# EAGLE design protomesure (EAGLE 8.1.1)
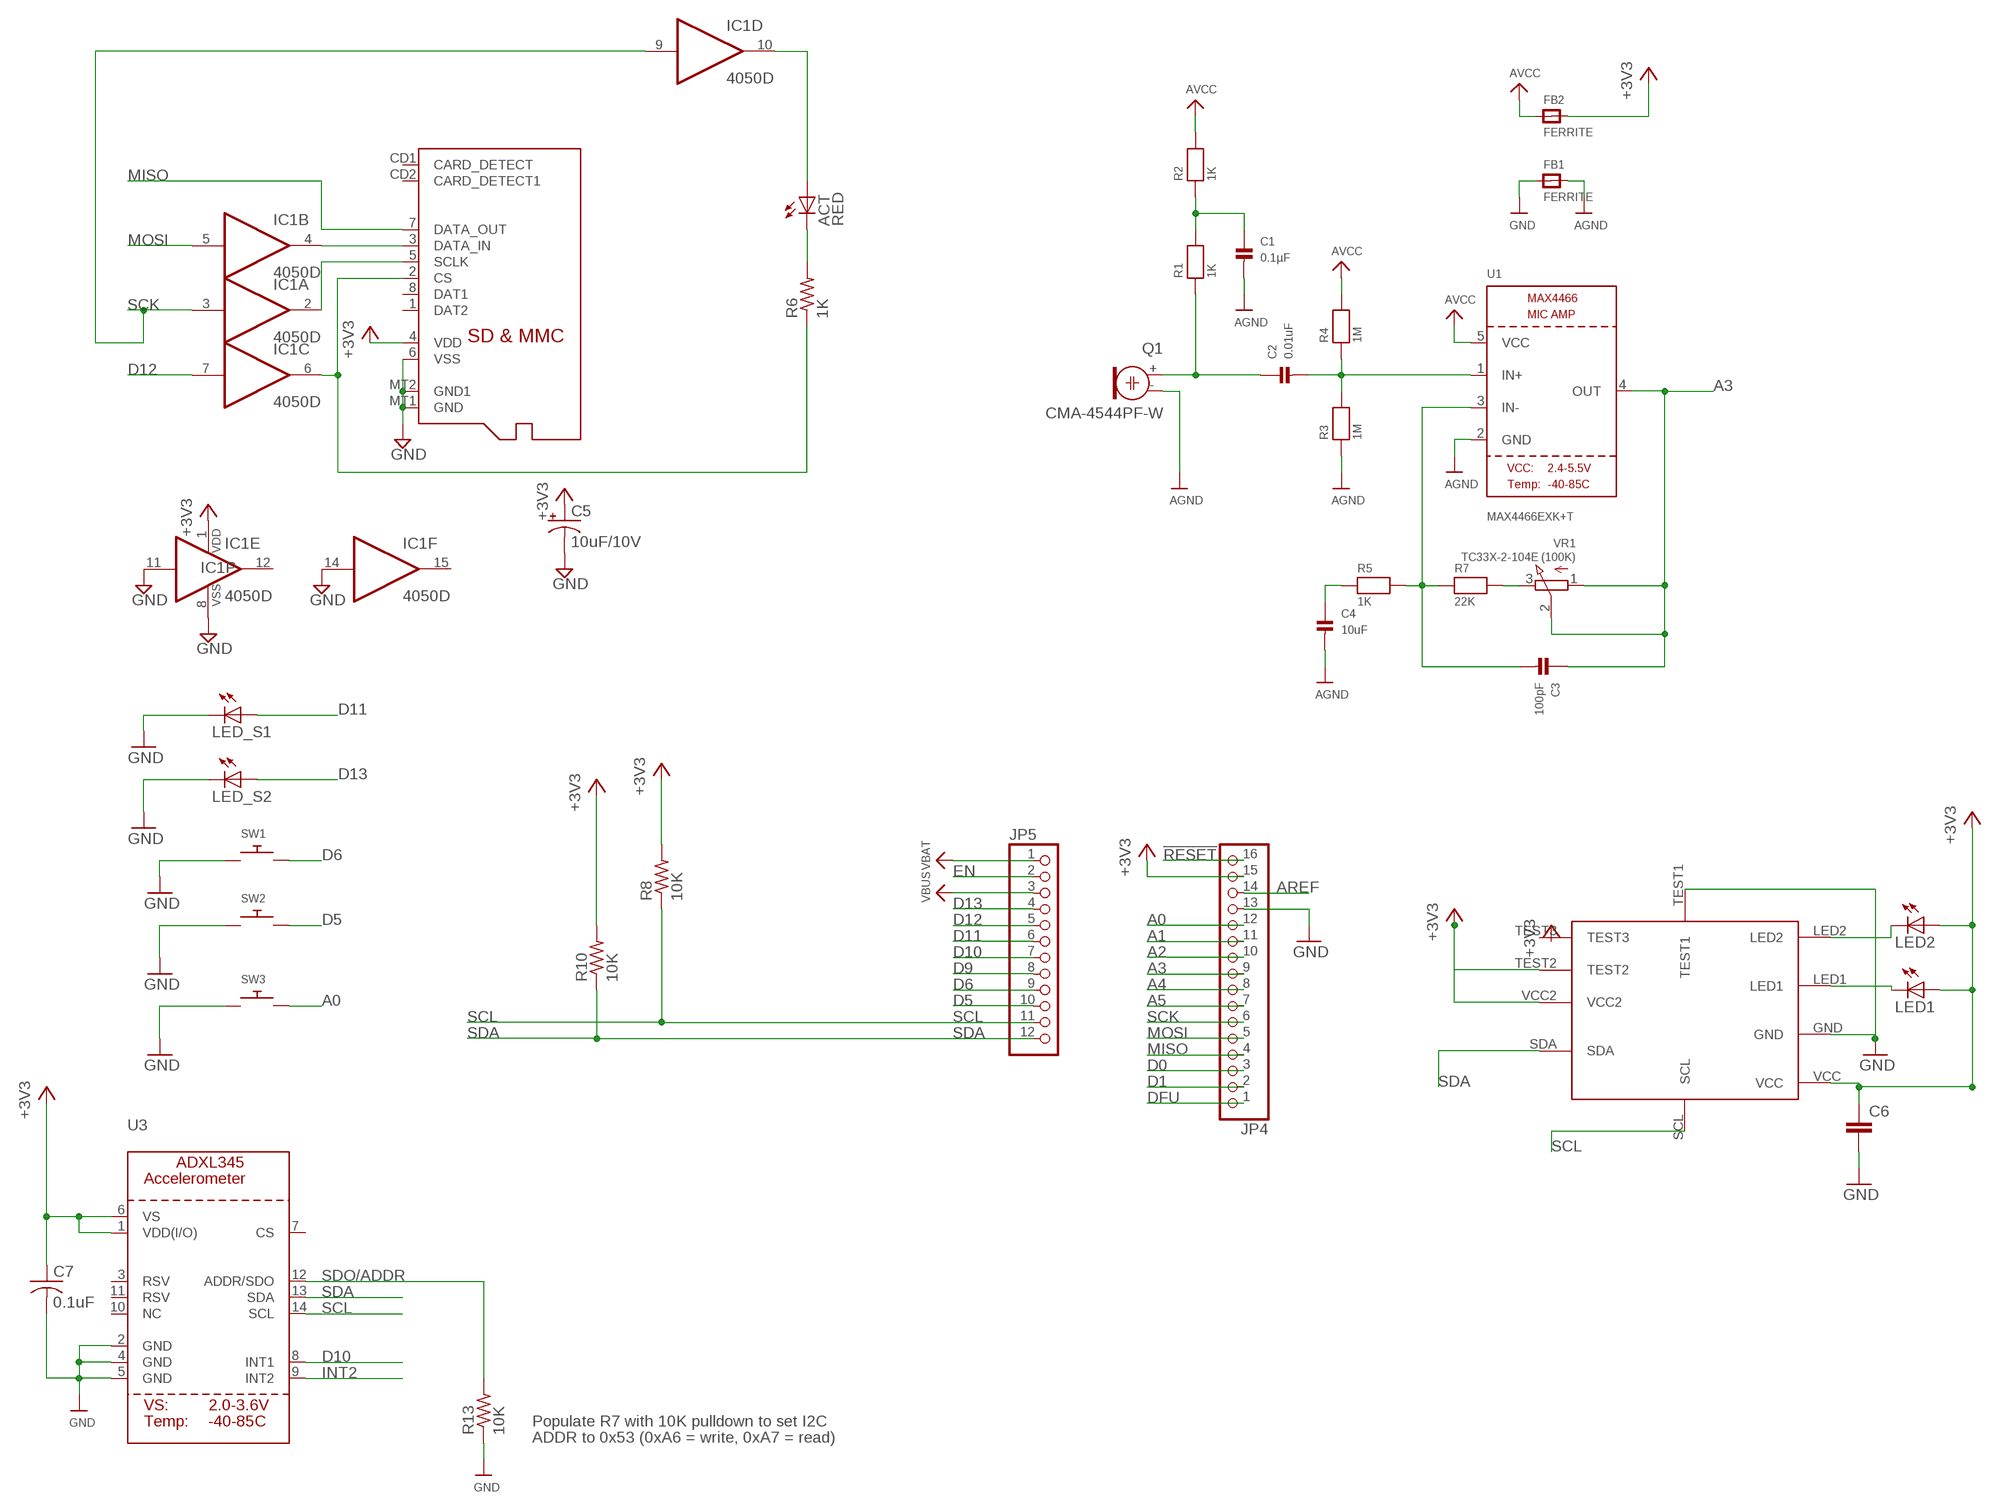
[diagram p0: schematic, sheet 1]

## Parts
ACT  RED  LEDCHIP-LED0805  [CHIP-LED0805]
C1  0.1µF  CAP_CERAMIC0805  [0805]
C2  0.01uF  CAP_CERAMIC0805  [0805]
C3  100pF  CAP_CERAMIC0805  [0805]
C4  10uF  CAP_CERAMIC0805  [0805]
C5  10uF/10V  CPOL-USA/3216-18R  [A/3216-18R]
C6  C-EUC0805  [C0805]
C7  0.1uF  C-USC0805  [C0805]
FB1  FERRITE  FERRITE0805  [0805]
FB2  FERRITE  FERRITE0805  [0805]
IC1  4050D  [SO16]
JP4  HEADER-1X16ROUND  [1X16_ROUND]
JP5  HEADER-1X12  [1X12_ROUND]
LED1  LEDCHIPLED_0805  [CHIPLED_0805]
LED2  LEDCHIPLED_0805  [CHIPLED_0805]
LED_S1  LEDCHIPLED_0805  [CHIPLED_0805]
LED_S2  LEDCHIPLED_0805  [CHIPLED_0805]
Q1  CMA-4544PF-W  ELECTRET  [ELECTRET_9.7]
R1  1K  RESISTOR0805  [0805]
R2  1K  RESISTOR0805  [0805]
R3  1M  RESISTOR0805  [0805]
R4  1M  RESISTOR0805  [0805]
R5  1K  RESISTOR0805  [0805]
R6  1K  R-US_R0805  [R0805]
R7  22K  RESISTOR0805  [0805]
R8  10K  R-US_R0805  [R0805]
R10  10K  R-US_R0805  [R0805]
R13  10K  R-US_R0805  [R0805]
SW1  SWITCH_PUSHBUTTONEVQ-PE  [TACT_PANA-EVQ]
SW2  SWITCH_PUSHBUTTONEVQ-PE  [TACT_PANA-EVQ]
SW3  SWITCH_PUSHBUTTONEVQ-PE  [TACT_PANA-EVQ]
U1  MAX4466EXK+T  MAX4466""  [SC70-5]
U3  ACCEL_ADXL345  [LGA14]
U$31  BH1790  [BH1790]
VR1  TC33X-2-104E (100K)  TRIMPOTTC33X-2  [TRIMPOT_BOURNS_TC33X-2]
X1  MICROSD  [MICROSD]

## Nets
!RESET: JP4.16
+3V3: C5.+ C6.1 C7.1 FB2.2 IC1.1(P:VDD) JP4.15 LED1.A LED2.A R8.2 R10.2 U3.1(VDD(I/O)) U3.6(VS) U$31.TEST2 U$31.VCC U$31.VCC2 X1.4(VDD)
A0: JP4.12 SW3.P$2
A1: JP4.11
A2: JP4.10
A3: C3.1 JP4.9 U1.4(OUT) VR1.1(A) VR1.2(S)
A4: JP4.8
A5: JP4.7
AGND: C1.2 C4.2 FB1.2 Q1.- R3.1 U1.2(GND)
AREF: JP4.14
AVCC: FB2.1 R2.2 R4.2 U1.5(VCC)
D0: JP4.3
D1: JP4.2
D5: JP5.10 SW2.P$2
D6: JP5.9 SW1.P$2
D9: JP5.8
D10: JP5.7 U3.8(INT1)
D11: JP5.6 LED_S1.A
D12: IC1.7(C:I) JP5.5
D13: JP5.4 LED_S2.A
DFU: JP4.1
EN: JP5.2
GND: C5.- C6.2 C7.2 FB1.1 IC1.8(P:VSS) IC1.11(E:I) IC1.14(F:I) JP4.13 LED_S1.C LED_S2.C R13.1 SW1.P$1 SW2.P$1 SW3.P$1 U3.2(GND) U3.4(GND) U3.5(GND) U$31.GND U$31.TEST1 X1.6(VSS) X1.MT1(GND) X1.MT2(GND1)
INT2: U3.9(INT2)
MISO: JP4.4 X1.7(DATA_OUT)
MOSI: IC1.5(B:I) JP4.5
N$1: C3.2 R5.2 R7.1 U1.3(IN-)
N$2: R7.2 VR1.3(E)
N$3: C2.1 Q1.+ R1.1
N$4: C1.1 R1.2 R2.1
N$5: C2.2 R3.2 R4.1 U1.1(IN+)
N$6: LED1.C U$31.LED1
N$7: C4.1 R5.1
N$8: ACT.A IC1.10(D:O)
N$9: IC1.2(A:O) X1.5(SCLK)
N$10: IC1.6(C:O) R6.1 X1.2(CS)
N$11: ACT.C R6.2
N$12: IC1.4(B:O) X1.3(DATA_IN)
N$14: LED2.C U$31.LED2
SCK: IC1.3(A:I) IC1.9(D:I) JP4.6
SCL: JP5.11 R8.1 U3.14(SCL) U$31.SCL
SDA: JP5.12 R10.1 U3.13(SDA) U$31.SDA
SDO/ADDR: R13.2 U3.12(ADDR/SDO)
VBAT: JP5.1
VBUS: JP5.3
Unconnected: IC1.12(E:O) IC1.15(F:O) U3.3(RSV) U3.7(CS) U3.10(NC) U3.11(RSV) U$31.TEST3 X1.1(DAT2) X1.8(DAT1) X1.CD1(CARD_DETECT) X1.CD2(CARD_DETECT1)

## Notes on the sheet
- Populate R7 with 10K pulldown to set I2C
- ADDR to 0x53 (0xA6 = write, 0xA7 = read)

## Library data of the parts
ACT LED1 LED2 LED_S1 LED_S2 = adafruit:LED: LED OSRAM: - CHIPLED LG R971, LG N971, LY N971, LG Q971, LY Q971, LO R971, LY R971 LH N974, LH R974 LS Q976, LO Q976, LY Q976 LO Q996 - Hyper CHIPLED LW Q18S LB Q993, LB Q99A, LB R99A - SideLED LS A670, LO A670, LY A670, LG A670, LP A670 LB A673, LV A673, LT A673, LW A673 LH A674 LY A675 LS A676, LA A676, LO A676, LY A676, LW A676 LS A679, LY A679, LG A679 - Hyper Micro SIDELED® LS Y876, LA Y876, LO Y876, LY Y876 LT Y87S - SmartLED LW L88C, LW L88S LB L89C, LB L89S, LG L890 LS L89K, LO L89K, LY L89K LS L896, LA L896, LO L896, LY L896 - TOPLED LS T670, LO T670, LY T670, LG T670, LP T670 LSG T670, LSP T670, LSY T670, LOP T670, LYG T670 LG T671, LOG T671, LSG T671 LB T673, LV T673, LT T673, LW T673 LH T674 LS T676, LA T676, LO T676, LY T676, LB T676, LH T676, LSB T676, LW T676 LB T67C, LV T67C, LT T67C, LS T67K, LO T67K, LY T67K, LW E67C LS E67B, LA E67B, LO E67B, LY E67B, LB E67C, LV E67C, LT E67C LW T67C LS T679, LY T679, LG T679 LS T770, LO T770, LY T770, LG T770, LP T770 LB T773, LV T773, LT T773, LW T773 LH T774 LS E675, LA E675, LY E675, LS T675 LS T776, LA T776, LO T776, LY T776, LB T776 LHGB T686 LT T68C, LB T68C - Hyper Mini TOPLED® LB M676 - Mini TOPLED Santana® LG M470 LS M47K, LO M47K, LY M47K Source: http://www.osram.convergy.de/
C1-C4 = microbuilder:CAP_CERAMIC: Ceramic Capacitors 0402 - 0402 Surface Mount Capacitors 16pF 50V 5% [Digikey: 445-4899-2-ND] 18pF 50V 5% [Digikey: 490-1281-2-ND] 22pF 50V 5% [Digikey: 490-1283-2-ND] 68pF 50V 5% [Digikey: 490-1289-2-ND] 0.1uF 10V 10% [Digikey: 490-1318-2-ND] 1.0uF 6.3V 10% [Digikey: 490-1320-2-ND] 0603 - 0603 Surface Mount Capacitors 16 pF 50V 5% [Digikey: 445-5051-2-ND] 22 pF 50V [Digikey: PCC220ACVTR-ND] 33 pF 50V 5% [Digikey: 490-1415-1-ND] 56pF 50V 5% [Digikey: 490-1421-1-ND] 220pF 50V 5% [Digikey: 445-1285-1-ND] 680 pF 50V 2200 pF 50V 5% C0G [Digikey: 445-1297-1-ND] 5600 pF 100V 5% X7R [Digikey: 478-3711-1-ND] 0.1 µF 25V 10% [Digikey: PCC2277TR-ND] 0.22 µF 16V 10% X7R [Digikey: 445-1318-1-ND] 1.0 µF 25V 10% [Digikey: 445-5146-2-ND] 0603 - RF Specific 3pF 250V +/-0.1pF RF [Digikey: 712-1347-1-ND] 18 pF 250V 5% [Digikey: 478-3505-1-ND or 712-1322-1-ND] 56 pF 250V 5% C0G RF [Digikey: 490-4867-1-ND] 68 pF 250V RF [Digikey: 490-4868-1-ND] 0805 - 0805 Surface Mount Capacitors 220 pF 250V 2% RF Ceramic Capacitor [Digikey: 712-1398-1-ND] 1000 pF 50V 2% NP0 Ceramic Capacitor [Digikey: 478-3760-1-ND] 0.1 µF 25V 10% Ceramic Capacitor [Digikey: PCC1828TR-ND] 1.0 µF 16V 10% Ceramic Capacitor[Digikey: 490-1691-2-ND] 10.0 µF 10V 10% Ceramic Capacitor[Digikey: 709-1228-1-ND] 10.0 uF 16V 10% Ceramic Capacitor [Digikey: 478-5165-2-ND] 47 uF 6.3V 20% Ceramic Capacitor [Digikey: 587-1779-1-ND or 399-5506-1-ND] 1206 - 1206 Surface Mount Capacitors 47uF 10V 20% Ceramic Capacitor [Digikey: 490-5528-1-ND or 399-5508-1-ND or 445-6010-1-ND] 100uF 6.3V -20%, +80% Y5V Ceramic Capacitor (Digikey: 490-4512-1-ND, Mouser: 81-GRM31CF50J107ZE1L)
C5 = adafruit:CPOL-US: POLARIZED CAPACITOR, American symbol
C6 = resistor:C-EU: CAPACITOR, European symbol
C7 = adafruit:C-US: CAPACITOR, American symbol
FB1 FB2 = microbuilder:FERRITE: Ferrite Bead 0603 MMZ1608B121C - 120 Ohm @ 100MHz, 600mA, 0.15 Ohm DC Resistance - Digikey: 445-2164-1-ND BK1608HW121-T - 120 Ohm, 600mA Ferrite Chip - Digikey: 587-1876-2-ND 0805 HZ0805B272R-10 - 2.7K Ohm @ 100MHz, 200mA, 0.8 Ohm DC Resistance - Digikey: 240-2504-1-ND (see also Murata BLM21BD272SN1L) MMZ2012Y152B - 1.5K Ohm @ 100MHz, 500mA, 0.4 Ohm DC Resistance - Digikey: 445-1560-1-ND - Mainly for high frequency (80-400MHz) MMZ2012R102A - 1K Ohm @ 100MHz, 500mA, 0.3 Ohm DC Resistance - Digikey: 445-1555-2-ND - More general purpose (10-200MHz)
IC1 = 40xx:4050: Hex non-inverting BUFFER
JP4 = microbuilder:HEADER-1X16: PIN HEADER
JP5 = microbuilder:HEADER-1X12
Q1 = microbuilder:ELECTRET: Electret microphone Thru hole 2.54mm spacing with 9.7mm diameter
R1-R5 R7 = microbuilder:RESISTOR: Resistors 0402 - 0402 Surface Mount Package 22 Ohm 1% 1/16W [Digikey: 311-22.0LRTR-ND] 33 Ohm 5% 1/16W 1.0K 5% 1/16W 1.5K 5% 1/16W 2.0K 1% 1/16W 10.0K 1% 1/16W [Digikey: 311-10.0KLRTR-ND] 10.0K 5% 1/16W [Digikey: RMCF0402JT10K0TR-ND] 12.1K 1% 1/16W [Digikey: 311-22.0LRTR-ND] 100.0K 5% 1/16W 0603 - 0603 Surface Mount Package 0 Ohm 1/10 Watt 1% Resistor 15 Ohm 1/10 Watt 1% Resistor 33 Ohm 1/10 Watt 1% Resistor 49.9 Ohm 1/10 Watt 1% Resistor 100 Ohm 1/10 Watt 1% Resistor 150 Ohm 1/10 Watt 1% Resistor 240 Ohm 1/10 Watt 1% Resistor 390 Ohm 1/10 Watt 1% Resistor 560 Ohm 1/10 Watt 1% Resistor 680 Ohm 1/10 Watt 1% Resistor 750 Ohm 1/10 Watt 1% Resistor 1.0K Ohm 1/10 Watt 1% Resistor 1.5K Ohm 1/10 Watt 1% Resistor 2.0K Ohm 1/10 Watt 1% Resistor 2.2K Ohm 1/10 Watt 1% Resistor 3.3K Ohm 1/10 Watt 1% Resistor 4.7K Ohm 1/10 Watt 1% Resistor 10.0K Ohm 1/10 Watt 1% Resistor 12.0K Ohm 1/10 Watt 1% Resistor 12.1K Ohm 1/10 Watt 1% Resistor 20.0K Ohm 1/10 Watt 1% Resistor 33.0K Ohm 1/10 Watt 1% Resistor 100.0K Ohm 1/10 Watt 1% Resistor 0805 - 0805 Surface Mount Package 0 Ohm 1/8 Watt 1% Resistor 33 Ohm 1/8 Watt 1% Resistor 100 Ohm 1/8 Watt 1% Resistor 150 Ohm 1/8 Watt 1% Resistor 200 Ohm 1/8 Watt 1% Resistor 240 Ohm 1/8 Watt 1% Resistor 330 Ohm 1/8 Watt 1% Resistor 390 Ohm 1/8 Watt 1% Resistor 470 Ohm 1/8 Watt 1% Resistor 1.0K Ohm 1/8 Watt 1% Resistor 1.5K Ohm 1/8 Watt 1% Resistor 2.0K Ohm 1/8 Watt 1% Resistor 4.7K Ohm 1/8 Watt 1% Resistor 5.1K Ohm 1/8 Watt 1% Resistor 5.6K Ohm 1/8 Watt 1% Resistor 10.0K Ohm 1/8 Watt 1% Resistor 22.0K Ohm 1/8 Watt 1% Resistor 33.0K Ohm 1/8 Watt 1% Resistor 100K Ohm 1/8 Watt 1% Resistor 1206 - 1206 Surface Mount Package 2012 - 2010 Surface Mount Package 0.11 Ohm 1/2 Watt 1% Resistor - Digikey: RHM.11UCT-ND
R6 R8 R10 R13 = adafruit:R-US_: RESISTOR, American symbol
SW1-SW3 = adafruit:SWITCH_PUSHBUTTON: Buttons SOFTTOUCHSMD_SJ - Soft touch temporary push button (Super Junk Akihabara) Compatible with SKPMANE010 [Mouser: 688-SKPMAN] C&K_KSS = Digikey: KSS221GLFS
U1 = microbuilder:MAX4466: MAX4466 - Microphone Pre-Amp
U3 = microbuilder:ACCEL_ADXL345: ADXL345 - Digital 3-Axis Accelerometer (I2C/SPI)
U$31 = quentin:BH1790
VR1 = microbuilder:TRIMPOT: 3-Pin SMT Trimpots Bourns TC33 (X-2) Series 10K - Digikey: TC33X-2-103E 100K - Digikey: TC33X-104ECT-ND Bourns 3303 (W) Series 3mm 10K Single Turn - Digikey: 3303W-103ETR-ND 3mm 100K Single Turn - Digikey: 3303X-104ETR-ND
X1 = adafruit:MICROSD: Micro-SD / Transflash card holder with SPI pinout For the 3M # 2908-05WB-MG and/or 4UCON #19656 push-push type

## Board
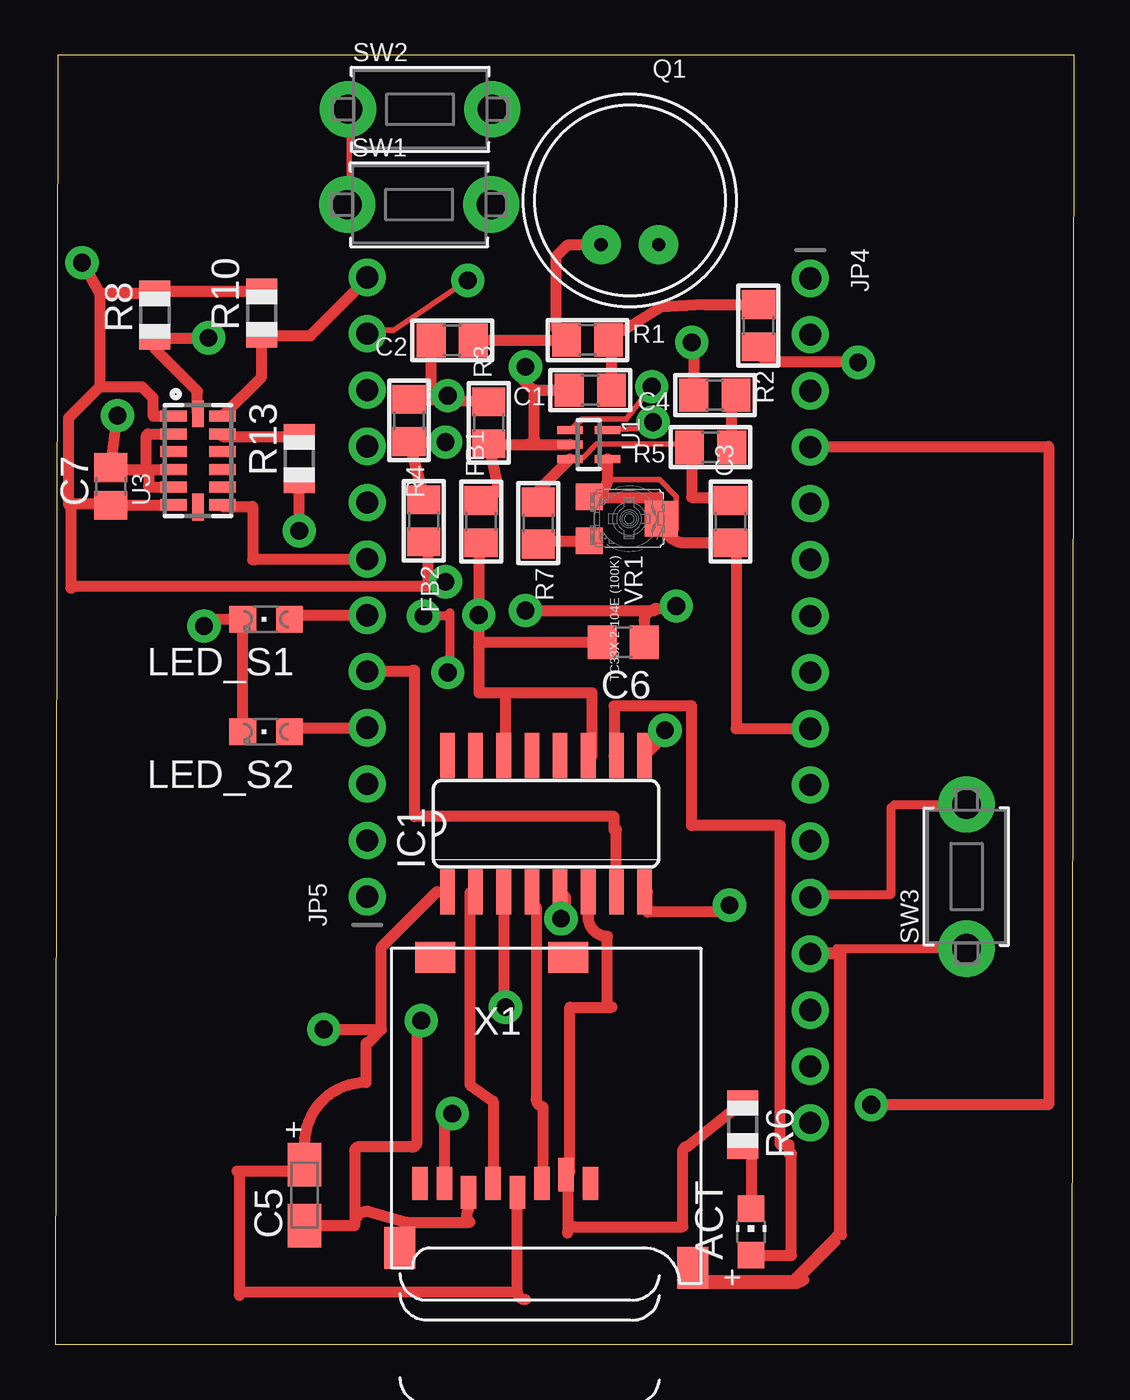
[diagram p1: board, top side]
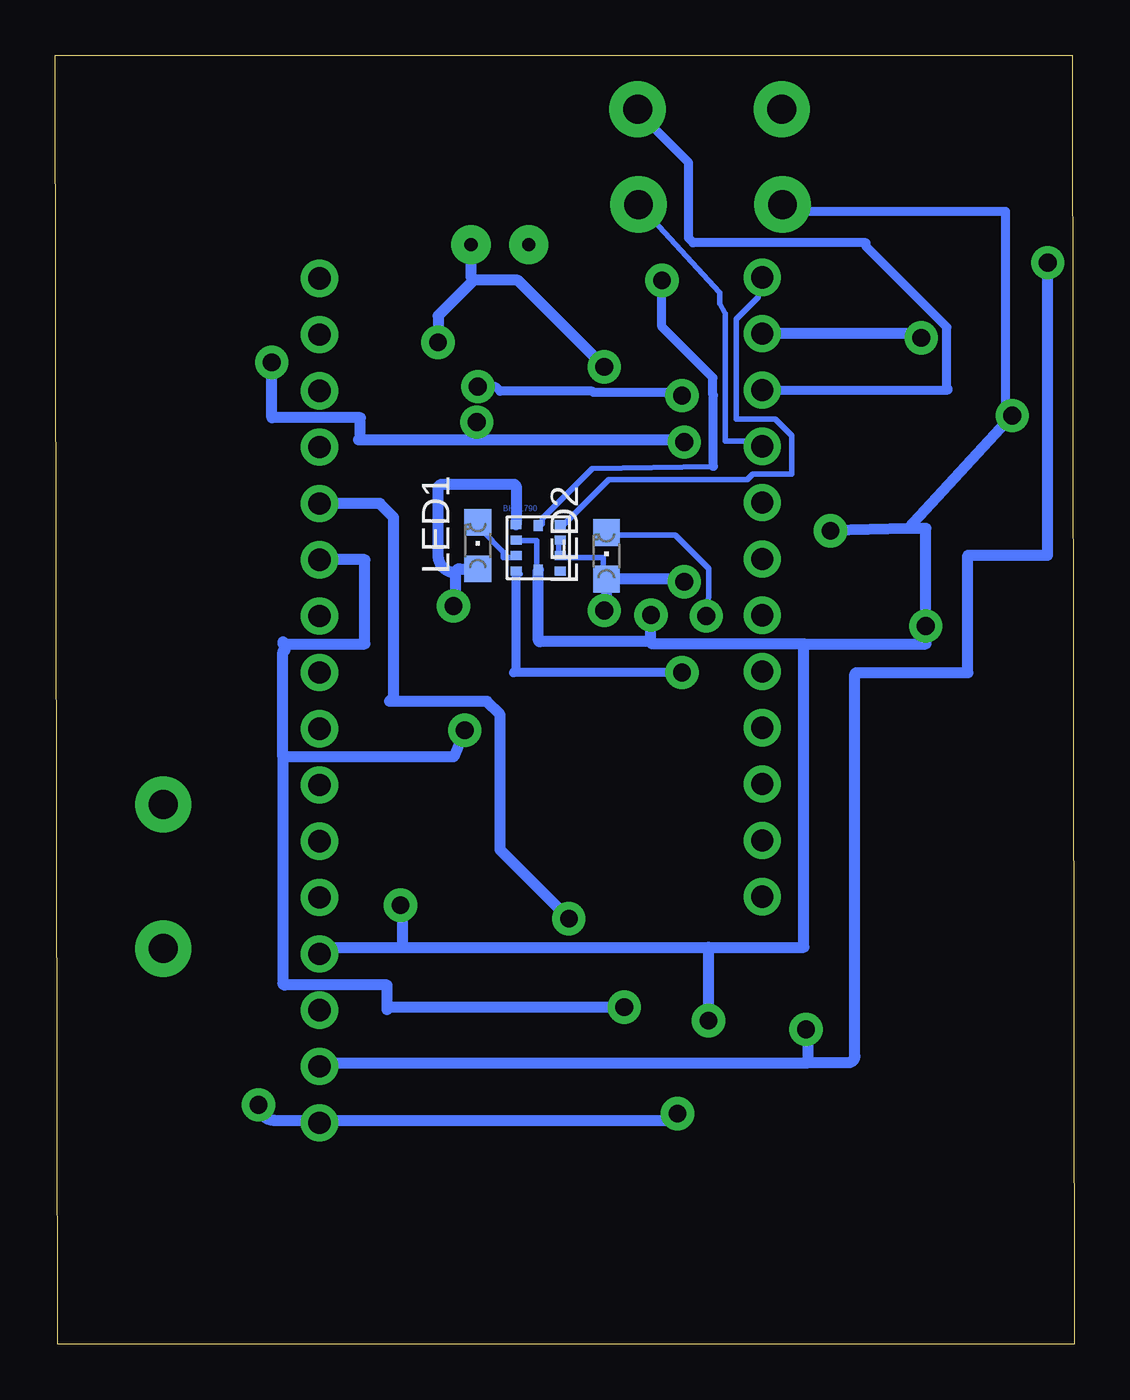
[diagram p2: board, bottom side, seen from below]

Size 45.96 x 58.15 mm. Coordinates in mm from the lower left corner, seen from the top.
Outline: 0,0 45.86,0 45.96,58.15 0.1,58.15 0,0
Copper layers (1*16): Top 0.035mm / dielectric 1.5mm / Bottom 0.035mm
Design rules "default": minimum track width 10mil, minimum drill 24mil, track to track 8mil, track to pad 8mil, pad to pad 8mil, via to via 8mil, smd to smd 8mil, copper to edge 40mil, drill to drill 8mil, minimum pad ring 10mil, minimum via ring 8mil, stop-mask expansion 4mil, vias tented up to drill 0mil, thermal gap 10mil

### Footprints (pad centres in the part's own frame; a part is rotated, then mirrored left to right if it is on the bottom)
CHIP-LED0805 = smd 1.2 x 1.2: A 0,-1.05; C 0,1.05
0805 = smd 1.3 x 1.5: 1 -0.95,0; 2 0.95,0
A/3216-18R = smd 1.95 x 1.5: + 1.375,0; - -1.375,0
C0805 = smd 1.3 x 1.5: 1 -0.95,0; 2 0.95,0
C0805' = smd 1.3 x 1.5: 1 -0.85,0; 2 0.85,0
SO16 = smd 0.66 x 2.032: 1 -4.445,-3.073; 2 -3.175,-3.073; 3 -1.905,-3.073; 4 -0.635,-3.073; 5 0.635,-3.073; 6 1.905,-3.073; 7 3.175,-3.073; 8 4.445,-3.073; 9 4.445,3.073; 10 3.175,3.073; 11 1.905,3.073; 12 0.635,3.073; 13 -0.635,3.073; 14 -1.905,3.073; 15 -3.175,3.073; 16 -4.445,3.073
1X16_ROUND = drill 1 pad 1.676: 1 -19.05,0; 2 -16.51,0; 3 -13.97,0; 4 -11.43,0; 5 -8.89,0; 6 -6.35,0; 7 -3.81,0; 8 -1.27,0; 9 1.27,0; 10 3.81,0; 11 6.35,0; 12 8.89,0; 13 11.43,0; 14 13.97,0; 15 16.51,0; 16 19.05,0
1X12_ROUND = drill 1 pad 1.676: 1 -13.97,0; 2 -11.43,0; 3 -8.89,0; 4 -6.35,0; 5 -3.81,0; 6 -1.27,0; 7 1.27,0; 8 3.81,0; 9 6.35,0; 10 8.89,0; 11 11.43,0; 12 13.97,0
CHIPLED_0805 = smd 1.2 x 1.2: A 0,-1.05; C 0,1.05
ELECTRET_9.7 = drill 0.6 pad 1.778: + 1.3,2; - -1.3,2
R0805 = smd 1.1 x 1.4: 1 -1,0; 2 1,0
TACT_PANA-EVQ = drill 1.3 pad 2.54: P$1 -3.25,0; P$2 3.25,0
SC70-5 = smd 0.35 x 1.15: 1 -0.65,-0.85; 2 0,-0.85; 3 0.65,-0.85; 4 0.65,0.85; 5 -0.65,0.85
LGA14 = smd 0.5 x 1.2: 1 2,1.1; 2 1.2,1.1; 3 0.4,1.1; 4 -0.4,1.1; 5 -1.2,1.1; 6 -2,1.1; 8 -2,-1.1; 9 -1.2,-1.1; 10 -0.4,-1.1; 11 0.4,-1.1; 12 1.2,-1.1; 13 2,-1.1 | smd 1.2 x 0.5: 7 -2.1,0; 14 2.1,0
BH1790 = smd 0.5 x 0.4: GND -1,0.35; LED1 -1,-0.35; LED2 -1,-1.05; SDA 1,1.05; TEST2 1,-0.35; TEST3 1,-1.05; VCC -1,1.05; VCC2 1,0.35 | smd 0.4 x 0.5: SCL 0,1; TEST1 0,-1
TRIMPOT_BOURNS_TC33X-2 = smd 1.2 x 1.2: 1 -1,-1.8; 3 1,-1.8 | smd 1.6 x 1.5: 2 0,1.45
MICROSD = smd 0.7 x 1.5: 1 9,-10.64; 2 7.9,-10.24; 3 6.8,-10.64; 4 5.7,-11.04; 5 4.6,-10.64; 6 3.5,-11.04; 7 2.4,-10.64; 8 1.3,-10.64 | smd 1.8 x 1.4: CD1 2,-0.44; CD2 8,-0.44 | smd 1.4 x 1.9: MT1 0.4,-13.54; MT2 13.6,-14.44

### Placement (x,y rotation side)
ACT  31.38,5.07 0 top
C1  24.13,43.05 180 top
C2  17.9,45.29 180 top
C3  30.45,37.11 90 top
C4  29.75,42.82 180 top
C5  11.23,6.72 90 top
C6  25.61,31.67 180 top
C7  0.1uF  [C0805']  2.5,38.7 90 top
FB1  19.2,37.11 90 top
FB2  16.61,37.15 270 top
IC1  22.13,23.48 0 top
JP4  34.05,29.04 270 top
JP5  14.07,34.16 90 top
LED1  26.91,36.03 0 bottom
LED2  21.11,35.57 0 bottom
LED_S1  9.5,32.71 90 top
LED_S2  9.5,27.63 90 top
Q1  25.91,51.61 180 top
R1  24,45.31 0 top
R2  31.71,45.95 270 top
R3  19.55,41.57 90 top
R4  15.95,41.68 270 top
R5  29.55,40.47 180 top
R6  31.01,9.91 270 top
R7  21.78,37.05 270 top
R8  4.49,46.43 90 top
R10  9.3,46.52 90 top
R13  11,39.96 90 top
SW1  16.41,51.42 0 top
SW2  16.45,55.72 0 top
SW3  41.1,21.1 90 top
U1  24.06,40.59 270 top
U3  6.43,39.87 90 top
U$31  24.18,35.93 0 bottom
VR1  25.88,37.24 270 top
X1  15.14,17.89 0 top

### Tracks (layer width: path | path; a pad name or v marks a point on that pad's centre or on a via)
+3V3  (via drill 0.8 pad 1.5)
  Top 0.254: FB2.2 16.75,36 16.75,35.75 16.8,35.6
  Top 0.5: U3.6 2.52,37.87 C7.1 2.45,37.9 0.6,37.9 | 0.6,37.9 0.6,41.8 2,43.2 | 2,43.2 3.9,43.2 4.4,42.7 4.4,41.9 4.43,41.87 U3.1 | 2,47.4 2,43.2 | 2,47.4 2.03,47.43 R8.2 4.58,47.52 R10.2 | v1.2,48.8 2,47.4 | 0.6,37.9 arc-90 0.7,37.8 0.7,34.1 arc-90 0.8,34.2 16.8,34.2 | 16.8,35.6 16.8,34.2 | v12.1,14.2 14.7,14.2 | 14.7,14.2 14.7,17.9 17.21,20.41 IC1.1 | 14.7,14.2 14.1,13.6 arc90 14,13.5 14,11.8 arc90 11.23,9.03 C5.+ arc-90 10.94,7.8 8.2,7.8 arc-90 8.3,7.7 8.3,2.2 arc-90 8.46,2.36 20.84,2.36 | 21.2,2 arc-90 20.84,2.36 | 20.84,2.36 X1.4 | 16.8,34.2 16.9,34.3 17.5,34.3 v17.6,34.4 | v21.2,33.1 27,33.1 | 27,33.1 arc90 26.56,32.66 C6.1 | 27,33.1 arc-90 27.1,33.2 28.1,33.2 arc-90 v28,33.3
  Bottom 0.254: U$31.VCC2 23.25,36.25 23.25,35.75 U$31.TEST2 23,35.5 21.25,35.5 21.25,34.75 LED2.A
  Bottom 0.5: 34,12.4 34.1,12.5 34.08,12.5 JP4.15 34.05,12.7 12,12.7 | v1.2,48.8 1.2,35.6 4.8,35.6 4.8,30.3 9.8,30.3 arc-90 9.9,30.2 9.9,13 arc90 10.2,12.7 12,12.7 | 12,12.7 12,14.2 v12.1,14.2 | v17.6,34.4 17.72,34.52 LED2.A 21.11,33.2 21.3,33.2 arc90 v21.2,33.1 | v28,33.3 arc-90 27.9,33.4 27.9,34.8 | 27.9,34.8 arc90 27.72,34.98 LED1.A | 27.9,34.8 arc90 28.7,35.6 28.7,38.6 arc90 28.5,38.8 25.3,38.8 arc90 25.18,38.68 U$31.VCC
A0
  Top 0.406: JP4.12 34.2,20.3 37.7,20.3 37.7,24.2 37.85,24.35 SW3.P$2
A3
  Top 0.254: 24.91,39.07 25,39 27.25,39 28,38.25 28,36.75 27.75,36.75 VR1.2
  Top 0.5: VR1.2 arc90 28.41,36.16 C3.1 30.7,35.91 30.7,27.77 JP4.9 | VR1.1 arc90 24.91,39.07 U1.4
AGND  (via drill 0.8 pad 1.5)
  Top 0.5: FB1.2 arc90 19.95,38.81 R3.1 arc90 20.08,40.59 21.3,40.59 | 21.3,40.59 U1.2 | 21.3,40.59 arc90 21.6,40.89 21.6,43 | 21.6,43 arc-90 21.65,43.05 C1.2 | 21.6,43 21.1,43.5 21.1,43.7 21.2,43.8 v21.2,44.1 | v28.7,45.2 28.8,45.1 C4.2
  Bottom 0.5: v21.2,44.1 25.1,48 27.1,48 | 27.1,48 27.2,48.1 27.2,49.1 27.21,49.11 Q1.- | 27.1,48 28.7,46.4 v28.7,45.2
AVCC  (via drill 0.8 pad 1.5)
  Top 0.254: v26.95,41.6 27.1,41.35 25,41.25 U1.5
  Top 0.5: FB2.1 arc90 16.65,38.14 R4.2 15.98,40.7 v17.6,40.7 | v36.2,44.3 32.1,44.3 31.71,44.69 R2.2
  Bottom 0.254: 27.25,40.8 v26.95,41.6
  Bottom 0.5: v17.6,40.7 17.7,40.8 27.25,40.8 32.3,40.8 32.2,40.9 32.2,41.8 36.2,41.8 v36.2,44.3
D5
  Bottom 0.254: 14,43.25 JP5.10 | SW2.P$2 19.5,55.5
  Bottom 0.406: JP5.10 5.7,43.05 5.7,43.1 5.74,43.14 5.74,45.88 9.4,49.53 9.4,49.7 17.2,49.7 17.4,49.9 17.4,53.3 19.7,55.6 SW2.P$2
D6
  Bottom 0.254: JP5.9 14.25,40.75 15.75,40.75 15.75,46.5 16,46.95 16,47.45 19.5,51.25 SW1.P$2
D10
  Top 0.5: U3.8 7.53,37.8 8.9,37.8 8.9,35.4 9,35.4 9,35.43 JP5.7
D11
  Top 0.5: LED_S1.A arc-90 10.73,32.89 JP5.6
D12
  Top 0.5: IC1.7 25.3,23.2 25.2,23.2 25.2,23.8 16.2,23.8 16.2,30.4 16.1,30.4 16.1,30.35 JP5.5
D13
  Top 0.5: LED_S2.A arc-90 10.73,27.81 JP5.4
GND  (via drill 0.8 pad 1.5)
  Top 0.254: SW1.P$1 13.25,51.5 13.25,55.5 SW2.P$1 | 15.85,5.5 15.75,4.5 X1.MT1 | FB1.1 19.25,36 19.25,35.5 19.1,35.5 | X1.MT2 28.75,3.25 29,3 33.25,3 35.25,5 35.25,17.5 34.25,17.5 JP4.13
  Top 0.406: X1.MT2 29.49,2.7 33.5,2.7 33.7,2.9 33.8,2.9 33.7,2.8 33.4,2.8 35.2,4.6 35.2,4.9 35.5,4.9 35.5,17.7 34,17.7 34,17.8 34.1,17.8 | 35.25,17.5 35.25,17.85 SW3.P$1
  Top 0.5: 4.2,39.47 2.58,39.47 C7.2 v2.8,41.9 | 4.2,39.47 U3.4 | 4.2,39.47 4.2,38.7 4.23,38.67 U3.5 | 4.2,39.47 4.1,39.57 4.1,41 4.17,41.07 U3.2 | v11,36.7 R13.1 | 19.1,35.5 v19.1,32.9 19.1,31.4 | 18.6,6.89 arc90 X1.6 18.64,6.06 arc90 18.7,5.5 15.85,5.5 14.1,6 arc90 13.5,5.4 | 16.6,14.7 arc90 v16.5,14.6 arc90 16.3,14.4 16.3,9.1 arc-90 16.1,8.9 13.7,8.9 arc90 13.5,8.7 13.5,5.4 | 13.5,5.4 arc-90 13.45,5.34 C5.- | 19.1,31.4 19.1,29.4 20.3,29.4 | 20.3,29.4 20.3,26.55 IC1.14 | IC1.11 24.2,26.55 24.2,29.4 20.3,29.4 | v30.4,19.8 30.4,19.5 26.7,19.5 26.7,20.41 IC1.8 | 19.1,31.4 arc-90 19.37,31.67 C6.2 | LED_S2.C LED_S1.C arc-90 LED_S1.C 6.7,32.7 v6.7,32.4
  Bottom 0.254: U$31.GND 25,36.25 24.25,36.25 24.25,35 U$31.TEST1 | SW1.P$1 13,51.25 | 3,42 v2.8,41.9
  Bottom 0.406: v2.8,41.9 3.1,41.9 3.1,51.1 13.16,51.1 SW1.P$1
  Bottom 0.5: 7.5,36.8 v2.8,41.9 | 7.5,36.8 v11,36.7 | 34.05,18 JP4.13 34.05,17.9 30.3,17.9 | 6.7,31.9 v6.7,32.4 | v6.7,32.4 6.7,36.8 7.5,36.8 | v6.7,32.4 6.7,31.6 12.2,31.6 | 12.2,31.6 19,31.6 | 19,31.6 arc90 19.1,31.7 | 19.1,31.7 v19.1,32.9 | 16.5,17.9 12.2,17.9 12.2,31.6 | v16.5,14.6 16.5,17.9 | 30.3,17.9 16.5,17.9 | 30.3,17.9 30.3,19.7 30.2,19.7 30.2,19.8 v30.4,19.8 | 19,31.6 arc-90 19.1,31.7 | 19.1,31.7 24.1,31.7 arc90 24.18,31.78 U$31.TEST1
MISO  (via drill 0.8 pad 1.5)
  Top 0.5: JP4.4 34.05,40.5 44.8,40.5 44.8,10.8 v36.8,10.8 | v17.9,10.4 arc90 17.54,10.04 X1.7
  Bottom 0.5: v36.8,10.8 arc-90 36.1,10.1 17.9,10.1 v17.9,10.4
MOSI  (via drill 0.8 pad 1.5)
  Top 0.5: IC1.5 23,20.17 23,19.3 22.9,19.2 v22.8,19.2
  Bottom 0.5: v22.8,19.2 25.9,22.3 25.9,28.4 26.5,29 30.9,29 30.7,29.2 30.7,37.3 31.33,37.93 JP4.5
N$1
  Top 0.25: R5.2 28.47,40.6 24.4,40.6 23.8,40 | 23.75,40 23.7,40
  Top 0.254: U1.3 23.25,40 23.75,40 23.8,40
  Top 0.5: 28.7,40.37 arc90 R5.2 arc-90 28.7,40.37 | 28.7,40.37 28.7,40.3 28.7,38.2 30.31,38.2 arc-90 C3.2 | U1.3 21.78,38.51 R7.1
N$2
  Top 0.5: R7.2 arc-90 21.92,36.24 VR1.3
N$3
  Top 0.5: C2.1 arc-90 18.87,45.31 R1.1 22.6,45.76 22.6,49.1 23.11,49.61 Q1.+
N$4
  Top 0.5: C1.1 25.08,45.18 arc90 R1.2 arc-90 25.04,45.4 27.3,46.8 29.3,46.9 R2.1
N$5  (via drill 0.8 pad 1.5, 0.81 pad 1.5)
  Top 0.254: v26.9,43.2 25.75,41.75 23.75,41.75 23.25,41.25 U1.1 | v17.7,42.8 18,42.57
  Top 0.5: R3.2 18,42.57 16.66,42.62 arc-90 R4.1 arc90 16.95,42.93 C2.2
  Bottom 0.406: v17.7,42.8 17.84,42.94 21.68,42.94 21.73,43 25.9,43 26.1,43.2 v26.9,43.2
N$6
  Bottom 0.254: U$31.LED1 25.25,35.5 25.75,35.5 25.75,35.75 26.75,36.75 26.75,37 LED1.C
N$7
  Top 0.5: R5.1 30.5,42.62 arc-90 C4.1
N$8
  Top 0.5: ACT.A 31.38,4 33.2,4 33.2,8.6 33.1,8.6 33.1,9 32.7,9 32.7,23.4 28.7,23.4 28.7,28.8 25.2,28.8 25.2,26.55 IC1.10
N$9
  Top 0.5: IC1.2 18.7,20.36 18.7,11.7 19.74,10.96 X1.5
N$10
  Top 0.5: IC1.6 24.04,19.27 arc90 24.9,18.4 24.9,15.4 arc90 25.1,15.2 23.2,15.2 23.2,7.81 arc-90 X1.2 arc-90 23.1,7.59 23.1,5 arc-90 23.4,5.3 28.3,5.3 28.3,8.7 arc-90 28.51,8.91 R6.1
N$11
  Top 0.5: R6.2 arc-90 31.38,8.54 ACT.C
N$12
  Top 0.5: X1.3 arc90 22,7.31 22,10.7 arc-90 21.7,11.1 21.7,19.7 arc-90 21.5,19.8 IC1.4
N$13
  Top 0.5: 24.1,38.2 27.2,38.2 27.2,37.3
N$14  (via drill 0.8 pad 1.5)
  Top 0.406: v17.7,30.3 17.8,30.4 17.8,33 17.65,32.85 v16.6,32.85
  Bottom 0.254: v16.6,32.85 16.5,33.75 16.5,35 18,36.5 21,36.5 LED2.C | U$31.LED2 25,34.75
  Bottom 0.406: v17.7,30.3 25.3,30.3 25.18,30.42 U$31.LED2
SCK  (via drill 0.8 pad 1.5)
  Top 0.5: IC1.3 20.23,15.28 arc90 v20.3,15.2 | IC1.9 27.3,27.28 27.6,27.7 v27.5,27.7
  Bottom 0.5: v20.3,15.2 30.9,15.2 arc-90 31,15.1 31,16.2 35.6,16.2 arc90 35.7,16.3 35.7,26.5 | 35.7,31.6 arc90 35.6,31.4 35.6,31.3 arc-90 35.7,31.2 35.7,26.5 | 35.7,31.7 35.7,31.6 | 35.7,31.6 32,31.6 32,35.4 JP4.6 arc-90 JP4.6 | v27.5,27.7 28,26.5 35.7,26.5
SCL  (via drill 0.8 pad 1.5)
  Top 0.254: v18.6,48 15.25,45.75 14.25,45.75 JP5.11
  Top 0.5: U3.14 6.4,42 6.4,43 4.49,44.91 R8.1 4.52,45.4 v6.9,45.4
  Bottom 0.254: 16.3,39.6 21.75,39.5 24,37.25 24,37 U$31.SCL
  Bottom 0.406: 16.3,39.6 16.28,39.62 16.28,42.8 16.3,42.82 16.3,43.6 18.6,45.9 v18.6,48
  Bottom 0.5: v6.9,45.4 7.09,45.59 JP5.11
SDA
  Top 0.5: JP5.12 14.07,48.07 11.5,45.5 9.32,45.5 R10.1 9.3,43.64 U3.13
  Bottom 0.254: U$31.SDA 23,37 21,39 14.75,39 14.5,39.25 12.75,39.25 12.75,41 13.5,41.75 15.25,41.75 15.25,46.25 14.25,47.25 14.25,48 JP5.12
SDO/ADDR
  Top 0.5: U3.12 7.53,40.96 R13.2